# EAGLE schematic ADC Wing Board (EAGLE 9.6.2)
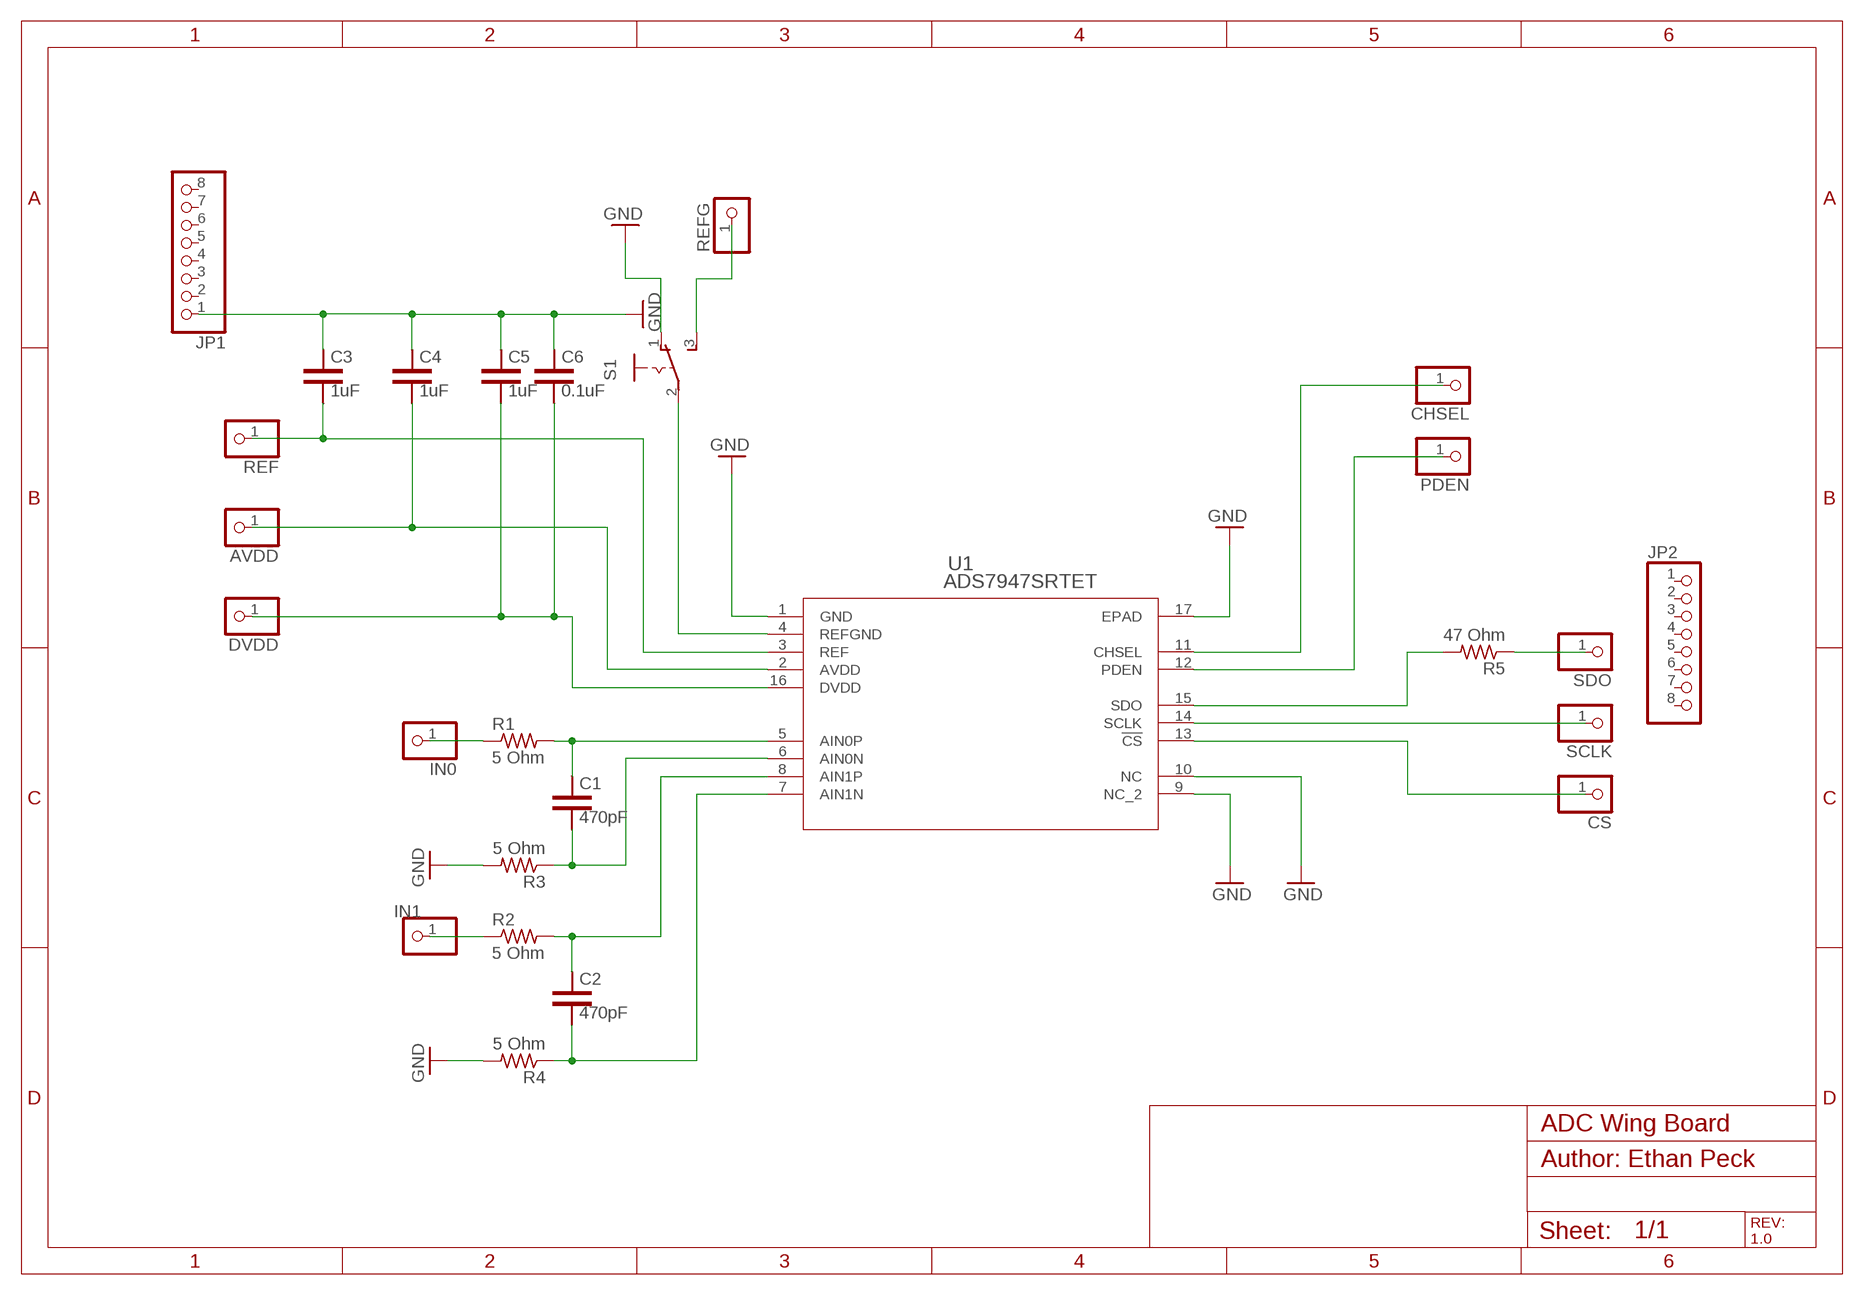
[diagram p0: schematic, sheet 1]

## Parts
AVDD  PINHD-1X1  [1X01]
C1  470pF  C-USC0805  [C0805]
C2  470pF  C-USC0805  [C0805]
C3  1uF  C-USC0805  [C0805]
C4  1uF  C-USC0805  [C0805]
C5  1uF  C-USC0805  [C0805]
C6  0.1uF  C-USC0805  [C0805]
CHSEL  PINHD-1X1  [1X01]
CS  PINHD-1X1  [1X01]
DVDD  PINHD-1X1  [1X01]
IN0  PINHD-1X1  [1X01]
IN1  PINHD-1X1  [1X01]
JP1  PINHD-1X8  [1X08]
JP2  PINHD-1X8  [1X08]
PDEN  PINHD-1X1  [1X01]
R1  5 Ohm  R-US_R0805  [R0805]
R2  5 Ohm  R-US_R0805  [R0805]
R3  5 Ohm  R-US_R0805  [R0805]
R4  5 Ohm  R-US_R0805  [R0805]
R5  47 Ohm  R-US_R0805  [R0805]
REF  PINHD-1X1  [1X01]
REFG  PINHD-1X1  [1X01]
S1  255SB  [255SB]
SCLK  PINHD-1X1  [1X01]
SDO  PINHD-1X1  [1X01]
U1  ADS7947SRTET  [RTE16_1P7X1P7]

## Nets
AIN0N [AIN0N]: C1.2 R3.1 U1.6(AIN0N)
AIN0P [AIN0P]: C1.1 R1.2 U1.5(AIN0P)
AIN1N [AIN1N]: C2.2 R4.1 U1.7(AIN1N)
AIN1P [AIN1P]: C2.1 R2.2 U1.8(AIN1P)
AVDD [AVDD]: AVDD.1 C4.2 U1.2(AVDD)
CHSEL [CHSEL]: CHSEL.1 U1.11(CHSEL)
CS [CS]: CS.1 U1.13(!CS)
DVDD [DVDD]: C5.2 C6.2 DVDD.1 U1.16(DVDD)
GND [GND]: C3.1 C4.1 C5.1 C6.1 JP1.1 R3.2 R4.2 S1.1(O) U1.1(GND) U1.9(NC_2) U1.10(NC) U1.17(EPAD)
IN0 [AIN0P]: IN0.1 R1.1
IN1: IN1.1 R2.1
N$1 [SDO]: R5.1 SDO.1
N$2: S1.2(P) U1.4(REFGND)
N$4: REFG.1 S1.3(S)
PDEN [PDEN]: PDEN.1 U1.12(PDEN)
REF [REF]: C3.2 REF.1 U1.3(REF)
SCLK [SCLK]: SCLK.1 U1.14(SCLK)
SDO [SDO]: R5.2 U1.15(SDO)
Unconnected: JP1.2 JP1.3 JP1.4 JP1.5 JP1.6 JP1.7 JP1.8 JP2.1 JP2.2 JP2.3 JP2.4 JP2.5 JP2.6 JP2.7 JP2.8

## Notes on the sheet
- Author: Ethan Peck
- REV: 
  1.0

## Library data of the parts
AVDD CHSEL CS DVDD IN0 IN1 PDEN REF REFG SCLK SDO = pinhead:PINHD-1X1: PIN HEADER
C1-C6 = rcl (modified us symbol):C-US: CAPACITOR, American symbol; SPICEPREFIX: C
JP1 JP2 = pinhead:PINHD-1X8: PIN HEADER
R1-R5 = rcl:R-US_: RESISTOR, American symbol; SPICEPREFIX: R
S1 = switch:255SB: SLIDING SWITCH Distributor Buerklin, 11G810
U1 = ADS7947:ADS7947SRTET: ADS7947 12 Bit ADC; DATASHEET_URL: http://www.ti.com/lit/gpn/ADS7947; DESCRIPTION: 12-Bit, 2 MSPS, Dual Channel, Pseudo-differential uPower Serial SAR ADC; FAMILY_NAME: PRECISION ADC (<=10MSPS); GENERIC_PART_NUMBER: ADS7947; INDUSTRY_STD_PKG_TYPE: WQFN; MANUFACTURER: Texas Instruments; PACKAGE_DESIGNATOR: RTE; PIN_COUNT: 16